# Altium schematic sheet Sheet3.SchDoc
size A4
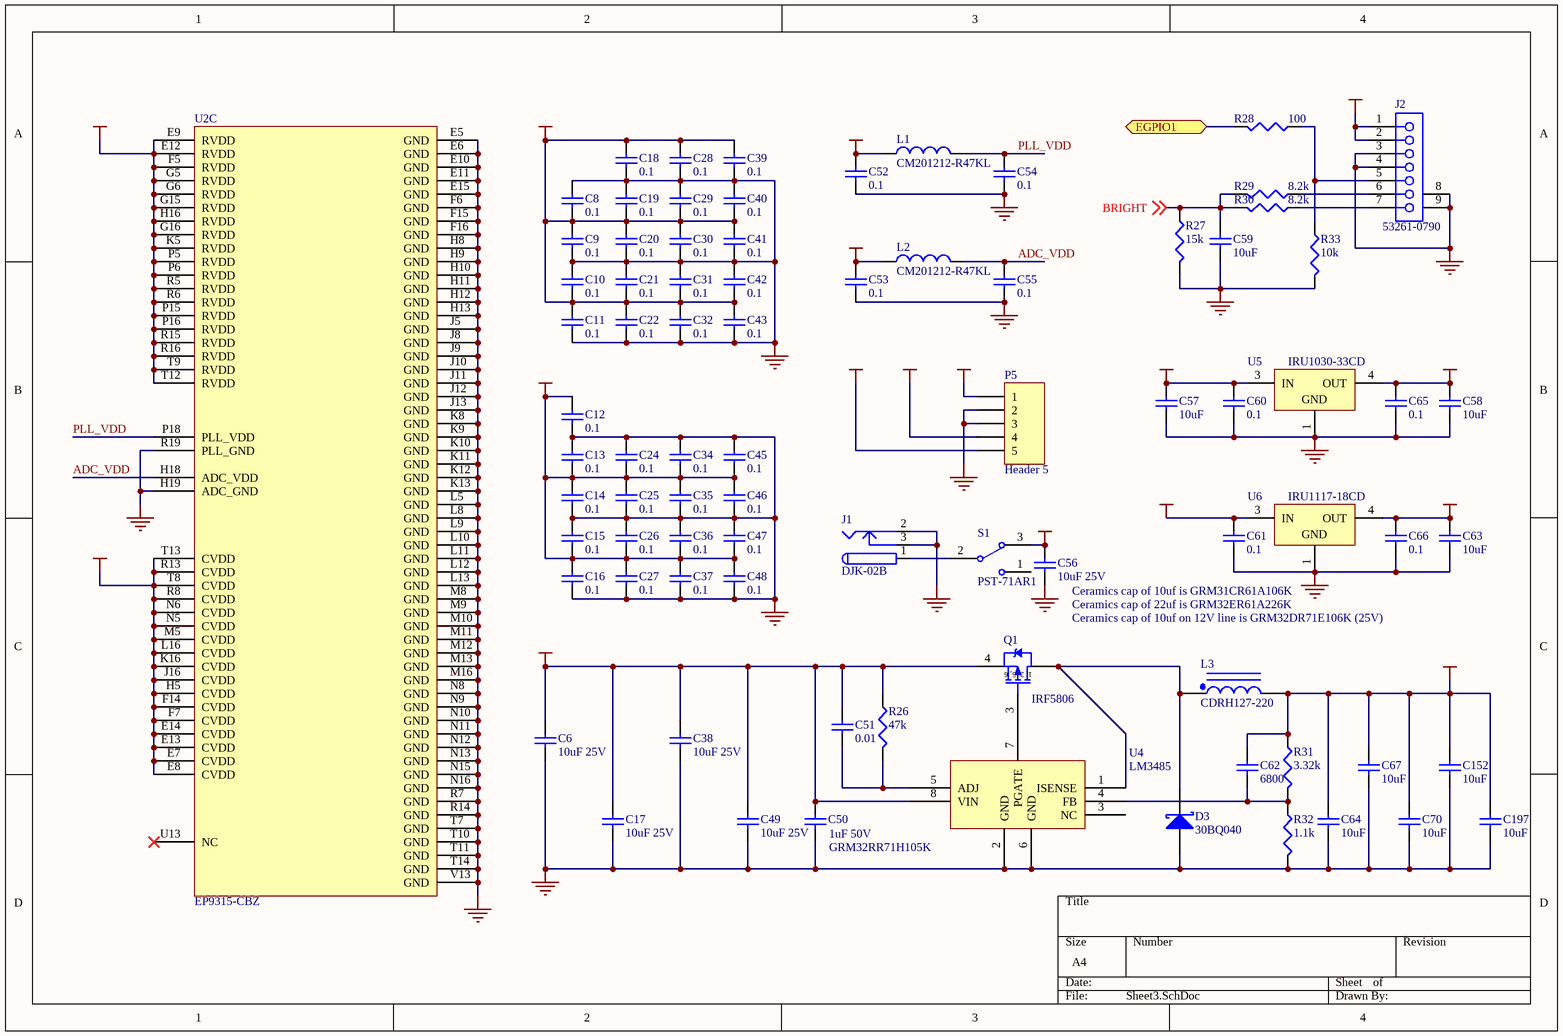
[diagram p0: Sheet3.SchDoc]

## Parts
C6  10uF 25V  [1210]
C8  0.1  [0603]
C9  0.1  [0603]
C10  0.1  [0603]
C11  0.1  [0603]
C12  0.1  [0603]
C13  0.1  [0603]
C14  0.1  [0603]
C15  0.1  [0603]
C16  0.1  [0603]
C17  10uF 25V  [1210]
C18  0.1  [0603]
C19  0.1  [0603]
C20  0.1  [0603]
C21  0.1  [0603]
C22  0.1  [0603]
C24  0.1  [0603]
C25  0.1  [0603]
C26  0.1  [0603]
C27  0.1  [0603]
C28  0.1  [0603]
C29  0.1  [0603]
C30  0.1  [0603]
C31  0.1  [0603]
C32  0.1  [0603]
C34  0.1  [0603]
C35  0.1  [0603]
C36  0.1  [0603]
C37  0.1  [0603]
C38  10uF 25V  [1210]
C39  0.1  [0603]
C40  0.1  [0603]
C41  0.1  [0603]
C42  0.1  [0603]
C43  0.1  [0603]
C45  0.1  [0603]
C46  0.1  [0603]
C47  0.1  [0603]
C48  0.1  [0603]
C49  10uF 25V  [1210]
C50  GRM32RR71H105K  value 1uF 50V  [1210]
C51  0.01  [0603]
C52  0.1  [0603]
C53  0.1  [0603]
C54  0.1  [0603]
C55  0.1  [0603]
C56  10uF 25V  [1210]
C57  10uF  [1206]
C58  10uF  [1206]
C59  10uF  [1206]
C60  0.1  [0603]
C61  0.1  [0603]
C62  6800  [0603]
C63  10uF  [1206]
C64  10uF  [1206]
C65  0.1  [0603]
C66  0.1  [0603]
C67  10uF  [1206]
C70  10uF  [1206]
C152  10uF  [1206]
C197  10uF  [1206]
D3  30BQ040  [DIODE SMC]
J1  DJK-02B  [DJK-02A]
J2  53261-0790  [53261-07]
L1  CM201212-R47KL  [INDC2012-0805]
L2  CM201212-R47KL  [INDC2012-0805]
L3  CDRH127-220  [CDRH127]
P5  Header 5  [HDR1X5]
Q1  IRF5806  [Micro6]
R26  47k  [CR1608-0603]
R27  15k  [CR1608-0603]
R28  value 100  [CR1608-0603]  (hidden comment: 0)
R29  value 8.2k  [CR1608-0603]  (hidden comment: 0)
R30  8.2k  [CR1608-0603]
R31  value 3.32k  [CR1608-0603]  (hidden comment: 3.6k)
R32  1.1k  [CR1608-0603]
R33  value 10k  [CR1608-0603]  (hidden comment: 0)
S1  PST-71AR1  [PST-71AR1]
U2  EP9315-CBZ  [BGA352x20]  (part C of 4)
U4  LM3485  [MSOP8]
U5  IRU1030-33CD  [TO-252-2 (D-PAK)]
U6  IRU1117-18CD  [TO-252-2 (D-PAK)]

## Ports
EGPIO1 (bidir)

## Nets
GND: C6.1 C8.2 C9.1 C10.2 C11.1 C12.1 C13.2 C14.1 C15.2 C16.1 C17.1 C18.1 C19.2 C20.1 C21.2 C22.1 C24.2 C25.1 C26.2 C27.1 C28.1 C29.2 C30.1 C31.2 C32.1 C34.2 C35.1 C36.2 C37.1 C38.1 C39.1 C40.2 C41.1 C42.2 C43.1 C45.2 C46.1 C47.2 C48.1 C49.1 C50.1 C52.1 C53.1 C54.1 C55.1 C56.1 C57.1 C58.1 C59.1 C60.1 C61.1 C63.1 C64.1 C65.1 C66.1 C67.1 C70.1 C152.1 C197.1 D3.1(A) J1.2 J1.3 J2.3 J2.4 J2.8 J2.9 P5.2 P5.3 R27.2 R32.2 R33.2 U2.E5(GND) U2.E6(GND) U2.E10(GND) U2.E11(GND) U2.E15(GND) U2.F6(GND) U2.F15(GND) U2.F16(GND) U2.H8(GND) U2.H9(GND) U2.H10(GND) U2.H11(GND) U2.H12(GND) U2.H13(GND) U2.H19(ADC_GND) U2.J5(GND) U2.J8(GND) U2.J9(GND) U2.J10(GND) U2.J11(GND) U2.J12(GND) U2.J13(GND) U2.K8(GND) U2.K9(GND) U2.K10(GND) U2.K11(GND) U2.K12(GND) U2.K13(GND) U2.L5(GND) U2.L8(GND) U2.L9(GND) U2.L10(GND) U2.L11(GND) U2.L12(GND) U2.L13(GND) U2.M8(GND) U2.M9(GND) U2.M10(GND) U2.M11(GND) U2.M12(GND) U2.M13(GND) U2.M16(GND) U2.N8(GND) U2.N9(GND) U2.N10(GND) U2.N11(GND) U2.N12(GND) U2.N13(GND) U2.N15(GND) U2.N16(GND) U2.R7(GND) U2.R14(GND) U2.R19(PLL_GND) U2.T7(GND) U2.T10(GND) U2.T11(GND) U2.T14(GND) U2.V13(GND) U4.2(GND) U4.6(GND) U5.1(GND) U6.1(GND)
VCC5V0: C57.2 C60.2 C62.2 C64.2 C67.2 C70.2 C152.2 C197.2 L3.2 P5.4 R31.1 U5.3(IN)
VCC12: C6.2 C17.2 C38.2 C49.2 C50.2 C51.2 C56.2 J2.1 J2.2 P5.1 Q1.4(S) R26.1 S1.3 U4.8(VIN)
VCCCORE: C12.2 C13.1 C14.2 C15.1 C16.2 C24.1 C25.2 C26.1 C27.2 C34.1 C35.2 C36.1 C37.2 C45.1 C46.2 C47.1 C48.2 C52.2 C63.2 C66.2 L1.1 U2.E7(CVDD) U2.E8(CVDD) U2.E13(CVDD) U2.E14(CVDD) U2.F7(CVDD) U2.F14(CVDD) U2.H5(CVDD) U2.J16(CVDD) U2.K16(CVDD) U2.L16(CVDD) U2.M5(CVDD) U2.N5(CVDD) U2.N6(CVDD) U2.R8(CVDD) U2.R13(CVDD) U2.T8(CVDD) U2.T13(CVDD) U6.4(OUT)
VCCIO: C8.1 C9.2 C10.1 C11.2 C18.2 C19.1 C20.2 C21.1 C22.2 C28.2 C29.1 C30.2 C31.1 C32.2 C39.2 C40.1 C41.2 C42.1 C43.2 C53.2 C58.2 C61.2 C65.2 L2.1 P5.5 U2.E9(RVDD) U2.E12(RVDD) U2.F5(RVDD) U2.G5(RVDD) U2.G6(RVDD) U2.G15(RVDD) U2.G16(RVDD) U2.H16(RVDD) U2.K5(RVDD) U2.P5(RVDD) U2.P6(RVDD) U2.P15(RVDD) U2.P16(RVDD) U2.R5(RVDD) U2.R6(RVDD) U2.R15(RVDD) U2.R16(RVDD) U2.T9(RVDD) U2.T12(RVDD) U5.4(OUT) U6.3(IN)
ADC_VDD: C55.2 L2.2 U2.H18(ADC_VDD)
BRIGHT: C59.2 R27.1 R29.2 R30.2 ; off-sheet BRIGHT
EGPIO1: R28.2 ; port EGPIO1
PLL_VDD: C54.2 L1.2 U2.P18(PLL_VDD)
NetC51_1: C51.1 R26.2 U4.5(ADJ)
NetC62_1: C62.1 R31.2 R32.1 U4.4(FB)
NetD3_2: D3.2(K) L3.1 Q1.1(D) Q1.2(D) Q1.5(D) Q1.6(D) U4.1(ISENSE)
NetJ1_1: J1.1 S1.2
NetJ2_5: J2.5 R28.1 R33.1
NetJ2_6: J2.6 R29.1
NetJ2_7: J2.7 R30.1
NetQ1_3: Q1.3(G) U4.7(PGATE)

Not connected (* = marked no-connect by the designer): S1 1; U2 U13(NC)*; U4 3(NC)

## Notes on the sheet
- Ceramics cap of 10uf is GRM31CR61A106K
- Ceramics cap of 10uf on 12V line is GRM32DR71E106K (25V)
- Ceramics cap of 22uf is GRM32ER61A226K
- (in symbol IRF5806) 1, 2, 5, 6

## Library data of the parts
C6 C17 C38 C49 C50 C56 = C1210: Ceramic Chip Capacitor - Standard; Published: 17-Jul-2002; LatestRevisionDate: 19-Mar-2004; LatestRevisionNote: Silkscreen size reduced.; DatasheetDocument: Mar-2001; PackageDocument: Mar-2001; PackageReference: 1210; Publisher: Altium Limited; Code_JEITA: 1210; Code_IPC: 3225 [1210]; ComponentLink1Description: Manufacturer Link; ComponentLink1URL: http://www.kemet.com/; ComponentLink2Description: Datasheet; ComponentLink2URL: http://www.kemet.com/kemet/web/homepage/kechome.nsf/vapubfilesname/F3102TA.pdf/$file/F3102TA.pdf
  C6 C17 C38 C49 C56: Value: 10uF
C8-C16 C18-C22 C24-C32 C34-C37 C39-C43 C45-C48 C52-C55 C60-C62 C65 C66 = C0603: Ceramic Chip Capacitor - Standard; Note: Footprint corresponds to dimensions for bulk cassette packaging. This case size has tightened tolerances.; Published: 17-Jul-2002; LatestRevisionDate: 19-Mar-2004; LatestRevisionNote: Silkscreen size reduced.; DatasheetDocument: Mar-2001; PackageDocument: Mar-2001; PackageReference: 0603; Publisher: Altium Limited; Code_JEITA: 0603; Code_IPC: 1608 [0603]; ComponentLink1Description: Manufacturer Link; ComponentLink1URL: http://www.kemet.com/; ComponentLink2Description: Datasheet; ComponentLink2URL: http://www.kemet.com/kemet/web/homepage/kechome.nsf/vapubfilesname/F3102TA.pdf/$file/F3102TA.pdf
  C8-C16 C18-C22 C24-C32 C34-C37 C39-C43 C45-C48 C52-C55 C60 C61 C65 C66: Value: 0.1
  C62: Value: 6800
C51 = C0603: Ceramic Chip Capacitor - Standard; Note: Footprint corresponds to dimensions for bulk cassette packaging. This case size has tightened tolerances.; Value: 0.1; Published: 17-Jul-2002; LatestRevisionDate: 19-Mar-2004; LatestRevisionNote: Silkscreen size reduced.; DatasheetDocument: Mar-2001; PackageDocument: Mar-2001; PackageReference: 0603; Publisher: Altium Limited; Code_JEITA: 0603; Code_IPC: 1608 [0603]; ComponentLink1Description: Manufacturer Link; ComponentLink1URL: http://www.kemet.com/; ComponentLink2Description: Datasheet; ComponentLink2URL: http://www.kemet.com/kemet/web/homepage/kechome.nsf/vapubfilesname/F3102TA.pdf/$file/F3102TA.pdf
C57-C59 C63 C64 C67 C70 C152 C197 = C1206: Ceramic Chip Capacitor - Standard; Published: 17-Jul-2002; LatestRevisionDate: 19-Mar-2004; LatestRevisionNote: Silkscreen size reduced.; DatasheetDocument: Mar-2001; PackageDocument: Mar-2001; PackageReference: 1206; Publisher: Altium Limited; Code_JEITA: 1206; Code_IPC: 3216 [1206]; ComponentLink1Description: Manufacturer Link; ComponentLink1URL: http://www.kemet.com/; ComponentLink2Description: Datasheet; ComponentLink2URL: http://www.kemet.com/kemet/web/homepage/kechome.nsf/vapubfilesname/F3102TA.pdf/$file/F3102TA.pdf; Value: 10uF
D3 = 10MQ060N: Schottky Rectifier; Package Information: Latest Revision: revH, May-2002; Published: 17-Sep-2003; Datasheet: Latest Revision: May-2002; Package Reference: SMA; Publisher: Altium Limited
J1 = DJK-02B: 2.5mm Power Plug
J2 = 53261-0790: Molex 1.25 Wire to board
L1 L2 = Inductor: Published: 8-Jun-2000; Revision: July-2002: Re-released for DXP Platform.; Publisher: Altium Limited; Value: CM201212-R47KL
L3 = CDRH127: Sumida Power Inductor
P5 = Header 5: Header, 5-Pin; LatestRevisionDate: 17-Jul-2002; LatestRevisionNote: Re-released for DXP Platform.; Publisher: Altium Limited
Q1 = IRF5806: HEXFET Power MOSFET
R26-R33 = Res3: Resistor; Published: 8-Jun-2000; Revision: July-2002: Re-released for DXP Platform.; Publisher: Altium Limited
  R26: Value: 47k
  R27: Value: 15k
  R30: Value: 8.2k
  R32: Value: 1.1k
U2 = EP9315-CBZ: 32 Bit ARM920T Microcontroller with inegrated graphics, IDE, PCMCIA, Ethernet
U4 = LM3485: Hysteretic PFET Buck Controller
U5 U6 = IRU1010: 1A low dropout positive fixed regulator